# Altium schematic sheet PSU.Schematic.SchDoc
size A
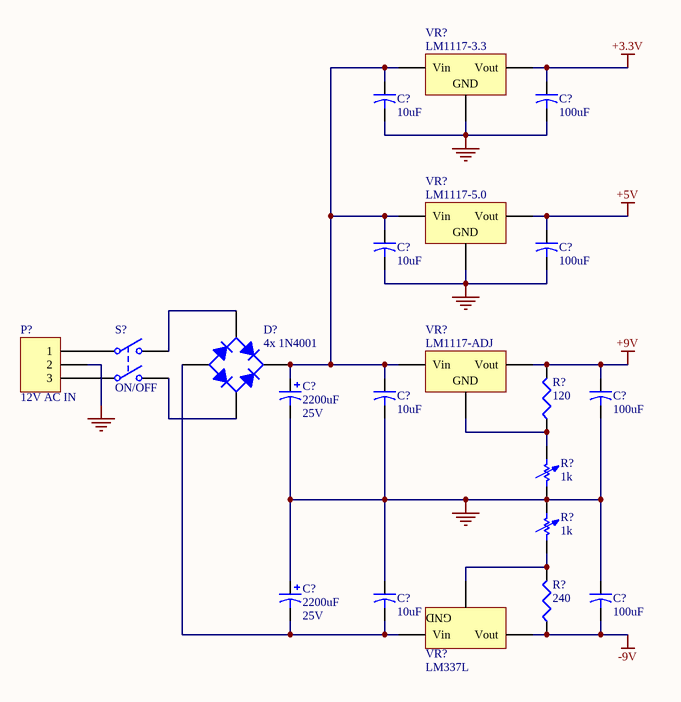
[diagram p0: PSU.Schematic.SchDoc]

## Parts
(Parts that share a designator on the sheet are numbered #1, #2 ... from top to bottom, then left to right.)
C?#1  10uF  [CAPR5-4X5]
C?#2  100uF  [CAPR5-4X5]
C?#3  10uF  [CAPR5-4X5]
C?#4  100uF  [CAPR5-4X5]
C?#5  2200uF  value 25V  [RB7.6-15]
C?#6  10uF  [CAPR5-4X5]
C?#7  100uF  [CAPR5-4X5]
C?#8  2200uF  value 25V  [RB7.6-15]
C?#9  10uF  [CAPR5-4X5]
C?#10  100uF  [CAPR5-4X5]
D?  4x 1N4001  [D-38]
P?  12V AC IN  [HDR1X3]
R?#1  120  [J1-0603]
R?#2  1k  [AXIAL-0.7]
R?#3  1k  [AXIAL-0.7]
R?#4  240  [J1-0603]
S?  ON/OFF  [DPST-4]
VR?#1  LM1117-3.3  [D2PAK_N]
VR?#2  LM1117-5.0  [D2PAK_N]
VR?#3  LM1117-ADJ  [D2PAK_N]
VR?#4  LM337L  [D2PAK_N]

## Nets
+3.3V: C?#2.1 VR?#1.3(Vout)
+5V: C?#4.1 VR?#2.3(Vout)
+9V: C?#7.1 R?#1.2 VR?#3.3(Vout)
-9V: C?#10.2 R?#4.1 VR?#4.3(Vout)
GND: C?#1.2 C?#2.2 C?#3.2 C?#4.2 C?#5.2 C?#6.2 C?#7.2 C?#8.1 C?#9.1 C?#10.1 P?.2 R?#2.1 R?#3.2 VR?#1.2(GND) VR?#2.2(GND)
NetC?#1_1: C?#1.1 C?#3.1 C?#5.1 C?#6.1 D?.1(K) VR?#1.1(Vin) VR?#2.1(Vin) VR?#3.1(Vin)
NetC?#8_2: C?#8.2 C?#9.2 D?.3(A) VR?#4.1(Vin)
NetD?_2: D?.2(C) S?.4(NO2)
NetD?_4: D?.4(C) S?.2(NO1)
NetP?_1: P?.1 S?.1(COMMON1)
NetP?_3: P?.3 S?.3(COMMON2)
NetR?#1_1: R?#1.1 R?#2.2 VR?#3.2(ADJ)
NetR?#3_1: R?#3.1 R?#4.2 VR?#4.2(ADJ)

## Notes on the sheet
- (in symbol Volt Reg) GND

## Library data of the parts
C?#1 C?#3 C?#6 C?#9 = Cap2: Capacitor; Value: 10u; Published: 23-Sep-2002; PackageReference: CAPR5-4X5; Publisher: Altium Limited; PackageDescription: Capacitor; 2 Leads
C?#2 C?#4 C?#7 C?#10 = Cap2: Capacitor; Value: 100u; Published: 23-Sep-2002; PackageReference: CAPR5-4X5; Publisher: Altium Limited; PackageDescription: Capacitor; 2 Leads
C?#5 C?#8 = Cap Pol1: Polarized Capacitor (Radial); Published: 8-Jun-2000; LatestRevisionDate: 17-Jul-2002; LatestRevisionNote: Re-released for DXP Platform.; PackageReference: RB7.6-15; Publisher: Altium Limited; PackageDescription: Polarized Capacitor (Radial); 2 Leads
D? = Bridge1: Full Wave Diode Bridge; Published: 8-Jun-2000; LatestRevisionDate: 29-May-2009; LatestRevisionNote: Sch pins A & K swapped.; DatasheetVersion: E2732B; PackageReference: D-38; Publisher: Altium Limited; PackageDescription: Bridge Rectifier; 4 Terminals; Body 9.4 x 9.4 mm (typ); Pitch 5.08 mm
P? = Header 3: Header, 3-Pin; LatestRevisionDate: 17-Jul-2002; LatestRevisionNote: Re-released for DXP Platform.; Publisher: Altium Limited
R?#1 R?#4 = Res3: Resistor; Published: 8-Jun-2000; LatestRevisionDate: 29-May-2009; LatestRevisionNote: IPC-7351 Footprint Added.; PackageReference: J1-0603; Publisher: Altium Limited; PackageDescription: Chip Resistor
  R?#1: Value: 120
  R?#4: Value: 240
R?#2 R?#3 = Res Adj1: Variable Resistor; Set Position: 0.5; Published: 8-Jun-2000; LatestRevisionDate: 17-Jul-2002; LatestRevisionNote: Re-released for DXP Platform.; PackageReference: AXIAL-0.7; Publisher: Altium Limited; PackageDescription: Axial Device, Thru-Hole; 2 Leads; 0.7 in Pin Spacing; Value: 1K
S? = SW-DPST: Double-Pole, Single-Throw Switch; Published: 24-Mar-1999; LatestRevisionDate: 17-Jul-2002; LatestRevisionNote: Re-released for DXP Platform.; PackageReference: DPST-4; Publisher: Altium Limited; PackageDescription: Switch; 4 Leads
VR?#1-VR?#4 = Volt Reg: Voltage Regulator; Published: 24-Mar-1999; LatestRevisionDate: 29-May-2009; LatestRevisionNote: IPC-7351 Footprint Added.; PackageReference: D2PAK; Publisher: Altium Limited; PackageDescription: 3-Pin Transistor Outline Package 2.54 mm Pitch, 15.1 mm Lead Span